# EAGLE schematic Chris Logger--Rev1 (EAGLE 7.7.0)
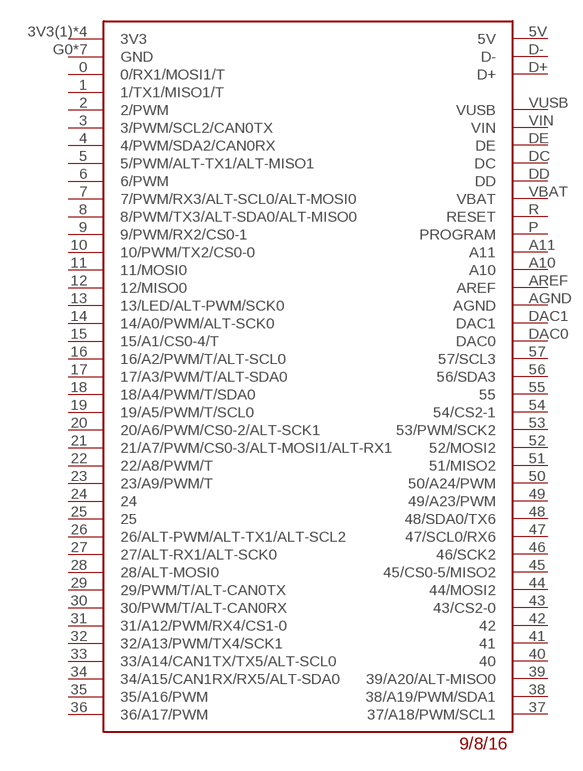
[diagram p0: schematic, sheet 1]

## Parts
U$2  TEENSY3_6--ALLPINS  [T36]
Unconnected: U$2.0(0/RX1/MOSI1/T) U$2.1(1/TX1/MISO1/T) U$2.2(2/PWM) U$2.3(3/PWM/SCL2/CAN0TX) U$2.3V3(1)(3V3) U$2.3V3(2)(3V3) U$2.3V3(3)(3V3) U$2.3V3(4)(3V3) U$2.4(4/PWM/SDA2/CAN0RX) U$2.5(5/PWM/ALT-TX1/ALT-MISO1) U$2.5V U$2.6(6/PWM) U$2.7(7/PWM/RX3/ALT-SCL0/ALT-MOSI0) U$2.8(8/PWM/TX3/ALT-SDA0/ALT-MISO0) U$2.9(9/PWM/RX2/CS0-1) U$2.10(10/PWM/TX2/CS0-0) U$2.11(11/MOSI0) U$2.12(12/MISO0) U$2.13(13/LED/ALT-PWM/SCK0) U$2.14(14/A0/PWM/ALT-SCK0) U$2.15(15/A1/CS0-4/T) U$2.16(16/A2/PWM/T/ALT-SCL0) U$2.17(17/A3/PWM/T/ALT-SDA0) U$2.18(18/A4/PWM/T/SDA0) U$2.19(19/A5/PWM/T/SCL0) U$2.20(20/A6/PWM/CS0-2/ALT-SCK1) U$2.21(21/A7/PWM/CS0-3/ALT-MOSI1/ALT-RX1) U$2.22(22/A8/PWM/T) U$2.23(23/A9/PWM/T) U$2.24 U$2.25 U$2.26(26/ALT-PWM/ALT-TX1/ALT-SCL2) U$2.27(27/ALT-RX1/ALT-SCK0) U$2.28(28/ALT-MOSI0) U$2.29(29/PWM/T/ALT-CAN0TX) U$2.30(30/PWM/T/ALT-CAN0RX) U$2.31(31/A12/PWM/RX4/CS1-0) U$2.32(32/A13/PWM/TX4/SCK1) U$2.33(33/A14/CAN1TX/TX5/ALT-SCL0) U$2.34(34/A15/CAN1RX/RX5/ALT-SDA0) U$2.35(35/A16/PWM) U$2.36(36/A17/PWM) U$2.37(37/A18/PWM/SCL1) U$2.38(38/A19/PWM/SDA1) U$2.39(39/A20/ALT-MISO0) U$2.40 U$2.41 U$2.42 U$2.43(43/CS2-0) U$2.44(44/MOSI2) U$2.45(45/CS0-5/MISO2) U$2.46(46/SCK2) U$2.47(47/SCL0/RX6) U$2.48(48/SDA0/TX6) U$2.49(49/A23/PWM) U$2.50(50/A24/PWM) U$2.51(51/MISO2) U$2.52(52/MOSI2) U$2.53(53/PWM/SCK2) U$2.54(54/CS2-1) U$2.55 U$2.56(56/SDA3) U$2.57(57/SCL3) U$2.A10 U$2.A11 U$2.AGND U$2.AREF U$2.D+ U$2.D- U$2.DAC0 U$2.DAC1 U$2.DC U$2.DD U$2.DE U$2.G0(GND) U$2.G1(GND) U$2.G2(GND) U$2.G3(GND) U$2.G4(GND) U$2.G5(GND) U$2.G6(GND) U$2.P(PROGRAM) U$2.R(RESET) U$2.VBAT U$2.VIN U$2.VUSB

## Library data of the parts
U$2 = Teensy_3_6:TEENSY3_6--ALLPINS